# Altium schematic sheet core.SchDoc
size A3
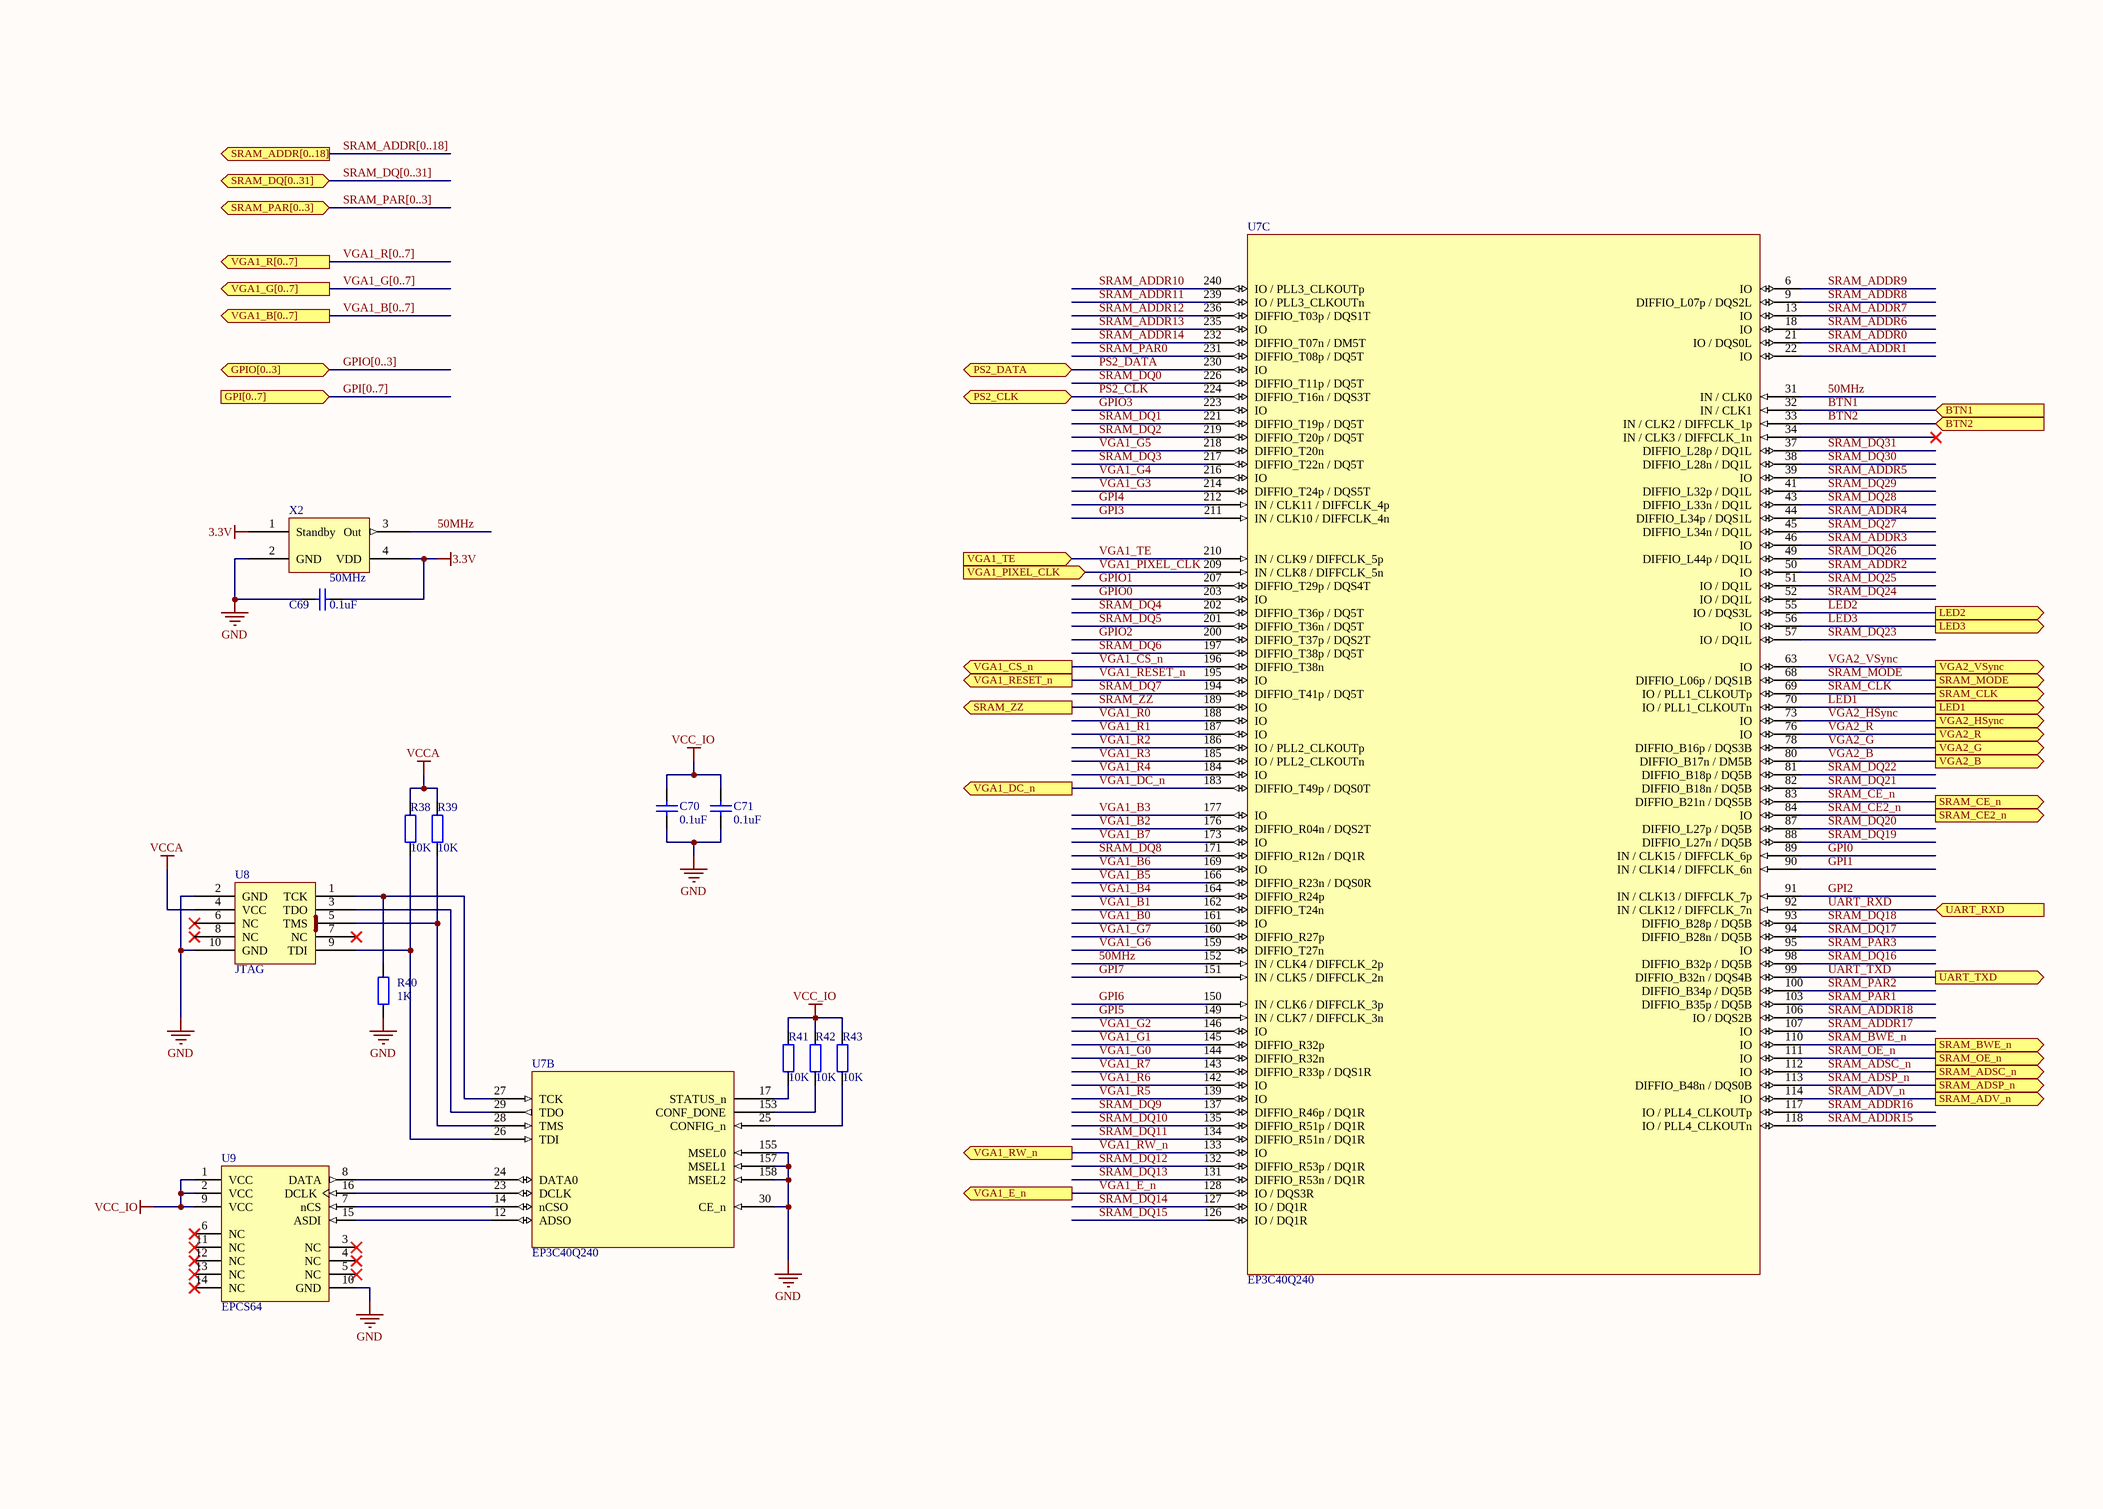
[diagram p0: core.SchDoc]

## Parts
C69  value 0.1uF  [0402]  (hidden comment: Cap)
C70  value 0.1uF  [0402]  (hidden comment: Cap)
C71  value 0.1uF  [0402]  (hidden comment: Cap)
R38  value 10K  [J1-0603]  (hidden comment: Res2)
R39  value 10K  [J1-0603]  (hidden comment: Res2)
R40  value 1K  [J1-0603]  (hidden comment: Res2)
R41  value 10K  [J1-0603]  (hidden comment: Res2)
R42  value 10K  [J1-0603]  (hidden comment: Res2)
R43  value 10K  [J1-0603]  (hidden comment: Res2)
U7  EP3C40Q240  [PQFP240]  (parts B,C of 3)
U8  JTAG  [JTAG_CONN]
U9  EPCS64  [SOIC16]
X2  50MHz  [ASDMB]

## Ports
BTN1 (in), BTN2 (in), GPI[0..7] (in), GPIO[0..3] (bidir), LED1 (out), LED2 (out), LED3 (out), PS2_CLK (bidir), PS2_DATA (bidir), SRAM_ADDR[0..18] (out), SRAM_ADSC_n (out), SRAM_ADSP_n (out), SRAM_ADV_n (out), SRAM_BWE_n (out), SRAM_CE2_n (out), SRAM_CE_n (out), SRAM_CLK (out), SRAM_DQ[0..31] (bidir), SRAM_MODE (out), SRAM_OE_n (out), SRAM_PAR[0..3] (bidir), SRAM_ZZ (out), UART_RXD (in), UART_TXD (out), VGA1_B[0..7] (out), VGA1_CS_n (out), VGA1_DC_n (out), VGA1_E_n (out), VGA1_G[0..7] (out), VGA1_PIXEL_CLK (in), VGA1_R[0..7] (out), VGA1_RESET_n (out), VGA1_RW_n (out), VGA1_TE (in), VGA2_B (out), VGA2_G (out), VGA2_HSync (out), VGA2_R (out), VGA2_VSync (out)

## Nets
3.3V: C69.2 X2.1(Standby) X2.4(VDD)
GND: C69.1 C70.1 C71.1 R40.1 U7.30(CE_n) U7.155(MSEL0) U7.157(MSEL1) U7.158(MSEL2) U8.2(GND) U8.10(GND) U9.10(GND) X2.2(GND)
VCC_IO: C70.2 C71.2 R41.1 R42.1 R43.1 U9.1(VCC) U9.2(VCC) U9.9(VCC)
VCCA: R38.1 R39.1 U8.4(VCC)
50MHz: U7.31(IN_/_CLK0) U7.152(IN_/_CLK4_/_DIFFCLK_2p) X2.3(Out)
BTN1: U7.32(IN_/_CLK1) ; port BTN1
BTN2: U7.33(IN_/_CLK2_/_DIFFCLK_1p) ; port BTN2
GPI0: U7.89(IN_/_CLK15_/_DIFFCLK_6p)
GPI1: U7.90(IN_/_CLK14_/_DIFFCLK_6n)
GPI2: U7.91(IN_/_CLK13_/_DIFFCLK_7p)
GPI3: U7.211(IN_/_CLK10_/_DIFFCLK_4n)
GPI4: U7.212(IN_/_CLK11_/_DIFFCLK_4p)
GPI5: U7.149(IN_/_CLK7_/_DIFFCLK_3n)
GPI6: U7.150(IN_/_CLK6_/_DIFFCLK_3p)
GPI7: U7.151(IN_/_CLK5_/_DIFFCLK_2n)
GPIO0: U7.203(IO)
GPIO1: U7.207(DIFFIO_T29p_/_DQS4T)
GPIO2: U7.200(DIFFIO_T37p_/_DQS2T)
GPIO3: U7.223(IO)
LED1: U7.70(IO_/_PLL1_CLKOUTn) ; port LED1
LED2: U7.55(IO_/_DQS3L) ; port LED2
LED3: U7.56(IO) ; port LED3
PS2_CLK: U7.224(DIFFIO_T16n_/_DQS3T) ; port PS2_CLK
PS2_DATA: U7.230(IO) ; port PS2_DATA
SRAM_ADDR0: U7.21(IO_/_DQS0L)
SRAM_ADDR1: U7.22(IO)
SRAM_ADDR2: U7.50(IO)
SRAM_ADDR3: U7.46(IO)
SRAM_ADDR4: U7.44(DIFFIO_L34p_/_DQS1L)
SRAM_ADDR5: U7.39(IO)
SRAM_ADDR6: U7.18(IO)
SRAM_ADDR7: U7.13(IO)
SRAM_ADDR8: U7.9(DIFFIO_L07p_/_DQS2L)
SRAM_ADDR9: U7.6(IO)
SRAM_ADDR10: U7.240(IO_/_PLL3_CLKOUTp)
SRAM_ADDR11: U7.239(IO_/_PLL3_CLKOUTn)
SRAM_ADDR12: U7.236(DIFFIO_T03p_/_DQS1T)
SRAM_ADDR13: U7.235(IO)
SRAM_ADDR14: U7.232(DIFFIO_T07n_/_DM5T)
SRAM_ADDR15: U7.118(IO_/_PLL4_CLKOUTn)
SRAM_ADDR16: U7.117(IO_/_PLL4_CLKOUTp)
SRAM_ADDR17: U7.107(IO)
SRAM_ADDR18: U7.106(IO_/_DQS2B)
SRAM_ADSC_n: U7.112(IO) ; port SRAM_ADSC_n
SRAM_ADSP_n: U7.113(DIFFIO_B48n_/_DQS0B) ; port SRAM_ADSP_n
SRAM_ADV_n: U7.114(IO) ; port SRAM_ADV_n
SRAM_BWE_n: U7.110(IO) ; port SRAM_BWE_n
SRAM_CE2_n: U7.84(IO) ; port SRAM_CE2_n
SRAM_CE_n: U7.83(DIFFIO_B21n_/_DQS5B) ; port SRAM_CE_n
SRAM_CLK: U7.69(IO_/_PLL1_CLKOUTp) ; port SRAM_CLK
SRAM_DQ0: U7.226(DIFFIO_T11p_/_DQ5T)
SRAM_DQ1: U7.221(DIFFIO_T19p_/_DQ5T)
SRAM_DQ2: U7.219(DIFFIO_T20p_/_DQ5T)
SRAM_DQ3: U7.217(DIFFIO_T22n_/_DQ5T)
SRAM_DQ4: U7.202(DIFFIO_T36p_/_DQ5T)
SRAM_DQ5: U7.201(DIFFIO_T36n_/_DQ5T)
SRAM_DQ6: U7.197(DIFFIO_T38p_/_DQ5T)
SRAM_DQ7: U7.194(DIFFIO_T41p_/_DQ5T)
SRAM_DQ8: U7.171(DIFFIO_R12n_/_DQ1R)
SRAM_DQ9: U7.137(DIFFIO_R46p_/_DQ1R)
SRAM_DQ10: U7.135(DIFFIO_R51p_/_DQ1R)
SRAM_DQ11: U7.134(DIFFIO_R51n_/_DQ1R)
SRAM_DQ12: U7.132(DIFFIO_R53p_/_DQ1R)
SRAM_DQ13: U7.131(DIFFIO_R53n_/_DQ1R)
SRAM_DQ14: U7.127(IO_/_DQ1R)
SRAM_DQ15: U7.126(IO_/_DQ1R)
SRAM_DQ16: U7.98(DIFFIO_B32p_/_DQ5B)
SRAM_DQ17: U7.94(DIFFIO_B28n_/_DQ5B)
SRAM_DQ18: U7.93(DIFFIO_B28p_/_DQ5B)
SRAM_DQ19: U7.88(DIFFIO_L27n_/_DQ5B)
SRAM_DQ20: U7.87(DIFFIO_L27p_/_DQ5B)
SRAM_DQ21: U7.82(DIFFIO_B18n_/_DQ5B)
SRAM_DQ22: U7.81(DIFFIO_B18p_/_DQ5B)
SRAM_DQ23: U7.57(IO_/_DQ1L)
SRAM_DQ24: U7.52(IO_/_DQ1L)
SRAM_DQ25: U7.51(IO_/_DQ1L)
SRAM_DQ26: U7.49(DIFFIO_L44p_/_DQ1L)
SRAM_DQ27: U7.45(DIFFIO_L34n_/_DQ1L)
SRAM_DQ28: U7.43(DIFFIO_L33n_/_DQ1L)
SRAM_DQ29: U7.41(DIFFIO_L32p_/_DQ1L)
SRAM_DQ30: U7.38(DIFFIO_L28n_/_DQ1L)
SRAM_DQ31: U7.37(DIFFIO_L28p_/_DQ1L)
SRAM_MODE: U7.68(DIFFIO_L06p_/_DQS1B) ; port SRAM_MODE
SRAM_OE_n: U7.111(IO) ; port SRAM_OE_n
SRAM_PAR0: U7.231(DIFFIO_T08p_/_DQ5T)
SRAM_PAR1: U7.103(DIFFIO_B35p_/_DQ5B)
SRAM_PAR2: U7.100(DIFFIO_B34p_/_DQ5B)
SRAM_PAR3: U7.95(IO)
SRAM_ZZ: U7.189(IO) ; port SRAM_ZZ
UART_RXD: U7.92(IN_/_CLK12_/_DIFFCLK_7n) ; port UART_RXD
UART_TXD: U7.99(DIFFIO_B32n_/_DQS4B) ; port UART_TXD
VGA1_B0: U7.161(IO)
VGA1_B1: U7.162(DIFFIO_T24n)
VGA1_B2: U7.176(DIFFIO_R04n_/_DQS2T)
VGA1_B3: U7.177(IO)
VGA1_B4: U7.164(DIFFIO_R24p)
VGA1_B5: U7.166(DIFFIO_R23n_/_DQS0R)
VGA1_B6: U7.169(IO)
VGA1_B7: U7.173(IO)
VGA1_CS_n: U7.196(DIFFIO_T38n) ; port VGA1_CS_n
VGA1_DC_n: U7.183(DIFFIO_T49p_/_DQS0T) ; port VGA1_DC_n
VGA1_E_n: U7.128(IO_/_DQS3R) ; port VGA1_E_n
VGA1_G0: U7.144(DIFFIO_R32n)
VGA1_G1: U7.145(DIFFIO_R32p)
VGA1_G2: U7.146(IO)
VGA1_G3: U7.214(DIFFIO_T24p_/_DQS5T)
VGA1_G4: U7.216(IO)
VGA1_G5: U7.218(DIFFIO_T20n)
VGA1_G6: U7.159(DIFFIO_T27n)
VGA1_G7: U7.160(DIFFIO_R27p)
VGA1_PIXEL_CLK: U7.209(IN_/_CLK8_/_DIFFCLK_5n) ; port VGA1_PIXEL_CLK
VGA1_R0: U7.188(IO)
VGA1_R1: U7.187(IO)
VGA1_R2: U7.186(IO_/_PLL2_CLKOUTp)
VGA1_R3: U7.185(IO_/_PLL2_CLKOUTn)
VGA1_R4: U7.184(IO)
VGA1_R5: U7.139(IO)
VGA1_R6: U7.142(IO)
VGA1_R7: U7.143(DIFFIO_R33p_/_DQS1R)
VGA1_RESET_n: U7.195(IO) ; port VGA1_RESET_n
VGA1_RW_n: U7.133(IO) ; port VGA1_RW_n
VGA1_TE: U7.210(IN_/_CLK9_/_DIFFCLK_5p) ; port VGA1_TE
VGA2_B: U7.80(DIFFIO_B17n_/_DM5B) ; port VGA2_B
VGA2_G: U7.78(DIFFIO_B16p_/_DQS3B) ; port VGA2_G
VGA2_HSync: U7.73(IO) ; port VGA2_HSync
VGA2_R: U7.76(IO) ; port VGA2_R
VGA2_VSync: U7.63(IO) ; port VGA2_VSync
NetR38_2: R38.2 U7.26(TDI) U8.9(TDI)
NetR39_2: R39.2 U7.28(TMS) U8.5(TMS)
NetR40_2: R40.2 U7.27(TCK) U8.1(TCK)
NetR41_2: R41.2 U7.17(STATUS_n)
NetR42_2: R42.2 U7.153(CONF_DONE)
NetR43_2: R43.2 U7.25(CONFIG_n)
NetU7_12: U7.12(ADSO) U9.15(ASDI)
NetU7_14: U7.14(nCSO) U9.7(nCS)
NetU7_23: U7.23(DCLK) U9.16(DCLK)
NetU7_24: U7.24(DATA0) U9.8(DATA)
NetU7_29: U7.29(TDO) U8.3(TDO)

Not connected (* = marked no-connect by the designer): U7 34(IN_/_CLK3_/_DIFFCLK_1n)*; U8 6(NC)* 7(NC)* 8(NC)*; U9 3(NC)* 4(NC)* 5(NC)* 6(NC)* 11(NC)* 12(NC)* 13(NC)* 14(NC)*

## Buses and harness runs
bus GPI[0..7] = port GPI[0..7]
bus GPIO[0..3] = port GPIO[0..3]
bus SRAM_ADDR[0..18] = port SRAM_ADDR[0..18]
bus SRAM_DQ[0..31] = port SRAM_DQ[0..31]
bus SRAM_PAR[0..3] = port SRAM_PAR[0..3]
bus VGA1_B[0..7] = port VGA1_B[0..7]
bus VGA1_G[0..7] = port VGA1_G[0..7]
bus VGA1_R[0..7] = port VGA1_R[0..7]

## Notes on the sheet
- Title
- Size:
- Date:
- A3
- Number:
- Time:
- Revision:
- Sheet
- of
- File:

## Library data of the parts
C69-C71 = Cap: Capacitor; Published: 8-Jun-2000; LatestRevisionDate: 17-Jul-2002; LatestRevisionNote: Re-released for DXP Platform.; PackageReference: RAD-0.3; Publisher: Altium Limited; PackageDescription: Radial Cap, Thru-Hole; 2 Leads; 0.3 in Pin Spacing
R38-R43 = Res2: Resistor; Published: 8-Jun-2000; LatestRevisionDate: 17-Jul-2002; LatestRevisionNote: Re-released for DXP Platform.; PackageReference: AXIAL-0.4; Publisher: Altium Limited; PackageDescription: Axial Device, Thru-Hole; 2 Leads; 0.4 in Pin Spacing
U8 = JTAG_CONN
U9 = EPCS16SI16N: EPCS16 Series, In-system programmable 3.3V serial configuration device, 16-Pin SOIC, 16-Megabit, Industrial Grade, Pb-Free; Configures: Cyclone II, Stratix II, & Cyclone Devices; Published: 4-Mar-2005; LatestRevisionDate: 13-Apr-2006; LatestRevisionNote: IPC-7351 Footprint Added.; DatasheetVersion: ver2.0, Oct-2003; PackageVersion: ver14.2, Oct-2005; PackageReference: SOIC16; Publisher: Altium Limited; PackageDescription: 16-Pin Small Outline Integrated Circuit Package (SOIC16); Supplier 1: Digi-Key; Supplier Part Number 1: 544-1240-5-ND; Supplier 2: Farnell; Supplier Part Number 2: 1453493; Supplier 3: Farnell; Supplier Part Number 3: 1662261; Code_JEDEC: MS-013-AA; Code_IPC: SOIC127P1030-16; ComponentLink1Description: Manufacturer Link; ComponentLink1URL: http://www.altera.com/products/devices/config/cfg-index.html; ComponentLink2Description: Configuration Handbook; ComponentLink2URL: http://www.altera.com/literature/hb/cfg/config_handbook.pdf; ComponentLink3Description: Pinout Specification; ComponentLink3URL: http://www.altera.com/literature/hb/cfg/config_handbook.pdf; ComponentLink4Description: Packaging Specification; ComponentLink4URL: http://www.altera.com/support/devices/packaging/specifications/pkg-pin/pdf/016-SOIC.pdf
X2 = ASDMB-50.000MHZ-LY-T